# EAGLE design controller (EAGLE 9.6.2)
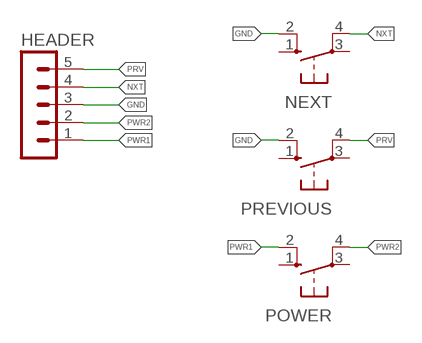
[diagram p0: schematic, sheet 1]

## Parts
HEADER  MA05-1  [MA05-1]
NEXT  10-XX  [B3F-10XX]
POWER  10-XX  [B3F-10XX]
PREVIOUS  10-XX  [B3F-10XX]

## Nets
GND: HEADER.3 NEXT.2(S1) PREVIOUS.2(S1)
NXT: HEADER.4 NEXT.4(P1)
PRV: HEADER.5 PREVIOUS.4(P1)
PWR1: HEADER.1 POWER.2(S1)
PWR2: HEADER.2 POWER.4(P1)
Unconnected: NEXT.1(S) NEXT.3(P) POWER.1(S) POWER.3(P) PREVIOUS.1(S) PREVIOUS.3(P)

## Library data of the parts
HEADER = con-lstb:MA05-1: PIN HEADER; OC_FARNELL: unknown; OC_NEWARK: unknown
NEXT POWER PREVIOUS = switch-omron:10-XX: OMRON SWITCH; MPN: B3F-1000; OC_FARNELL: 176432; OC_NEWARK: 36M3542

## Board
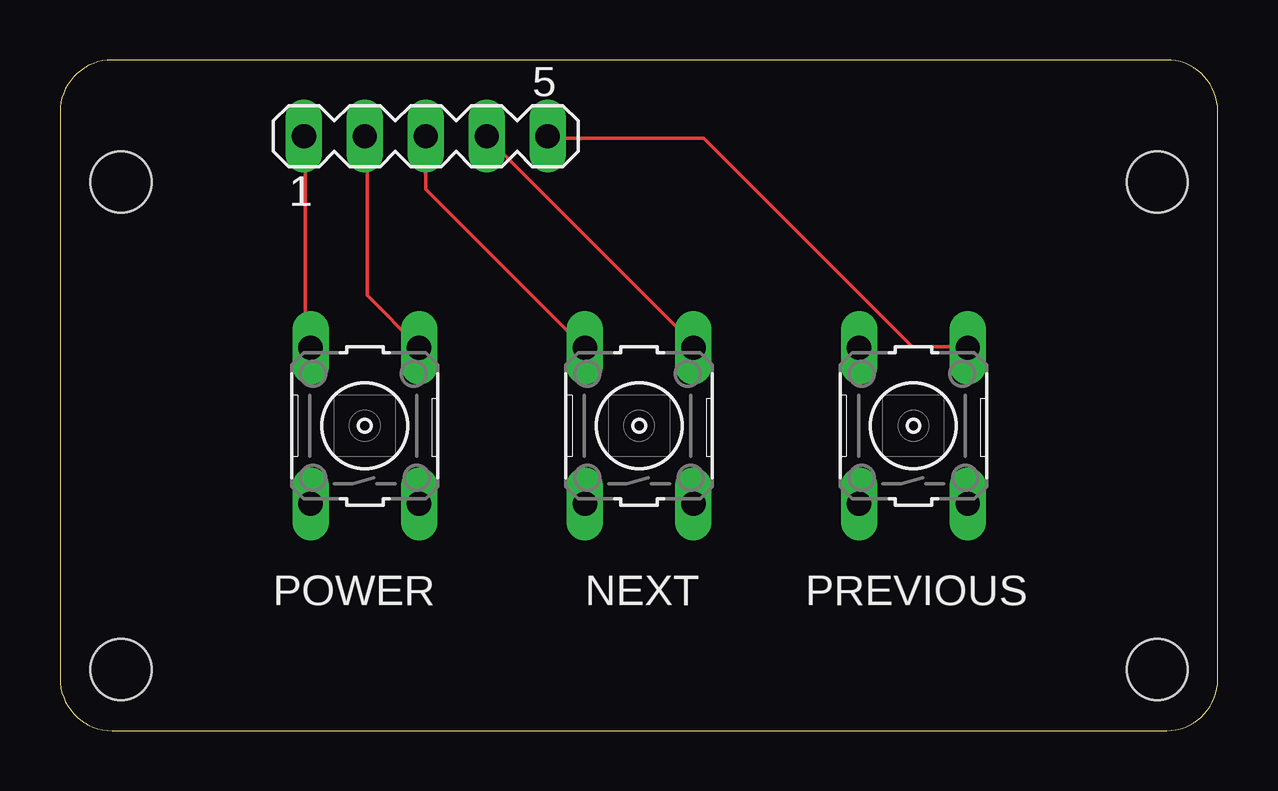
[diagram p1: board, top side]
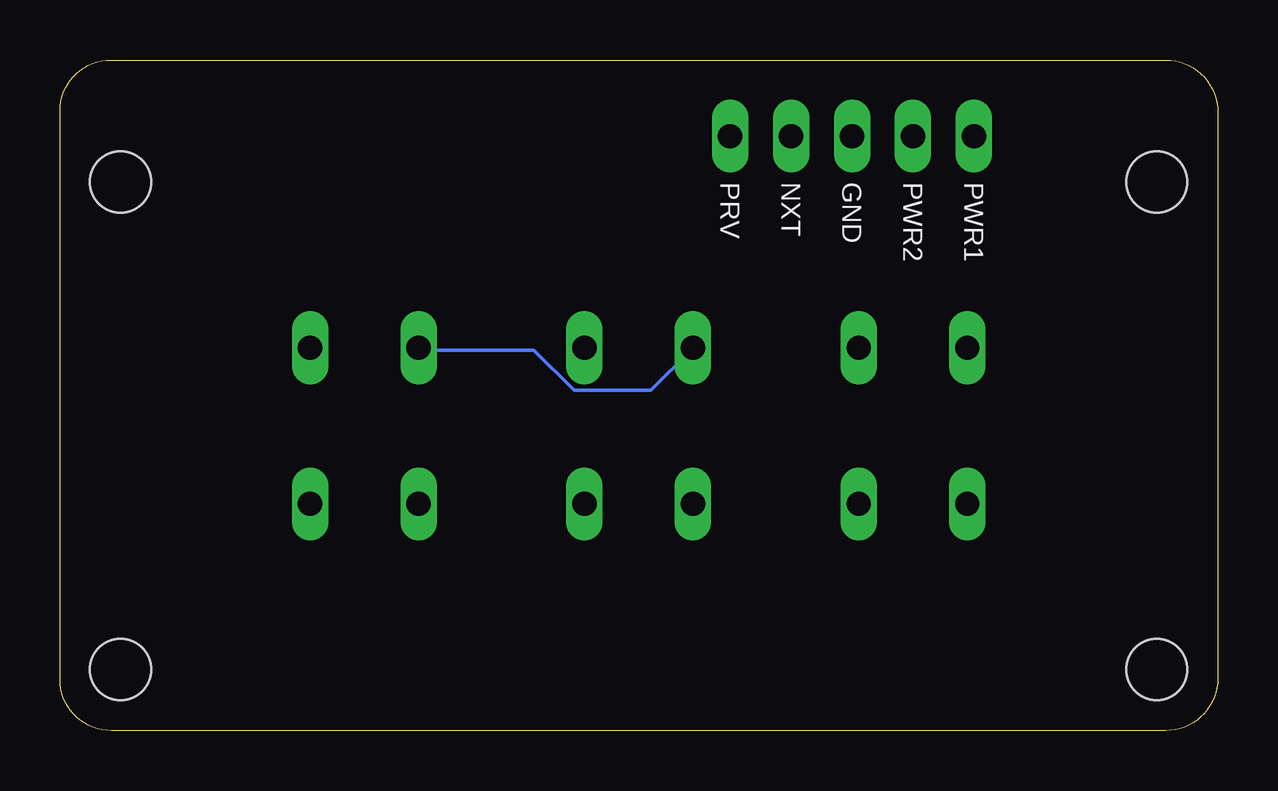
[diagram p2: board, bottom side, seen from below]

Size 48.24 x 27.94 mm. Coordinates in mm from the lower left corner, seen from the top.
Outline: 2.17,0 46.11,0 arc90 48.24,2.13 48.24,25.81 arc90 46.11,27.94 2.17,27.94 arc90 0,25.77 0,2.17 arc90 2.17,0
Copper layers (1*16): Top 0.035mm / dielectric 1.5mm / Bottom 0.035mm
Design rules "default": minimum track width 6mil, minimum drill 0.35mm, track to track 6mil, track to pad 6mil, pad to pad 6mil, via to via 6mil, smd to smd 6mil, copper to edge 40mil, drill to drill 6mil, minimum pad ring 10mil, minimum via ring 8mil, stop-mask expansion 4mil, vias tented up to drill 0mil, thermal gap 10mil
Holes 2.54 mm at 2.54,22.86 2.54,2.54 45.72,22.86 45.72,2.54

### Footprints (pad centres in the part's own frame; a part is rotated, then mirrored left to right if it is on the bottom)
MA05-1 = drill 1.016 long: 1 -5.08,0; 2 -2.54,0; 3 0,0; 4 2.54,0; 5 5.08,0
B3F-10XX = drill 1.016 long: 1 -3.251,2.261; 2 3.251,2.261; 3 -3.251,-2.261; 4 3.251,-2.261

### Placement (x,y rotation side)
HEADER  15.24,24.77 0 top
NEXT  24.13,12.7 90 top
POWER  12.7,12.7 90 top
PREVIOUS  35.56,12.7 90 top

### Tracks (layer width: path | path; a pad name or v marks a point on that pad's centre or on a via)
GND
  Top 0.152: HEADER.3 15.24,22.55 21.79,16 NEXT.2
  Bottom 0.152: PREVIOUS.2 33.22,15.85 28.5,15.85 26.82,14.17 23.62,14.17 21.95,15.85 NEXT.2
NXT
  Top 0.152: HEADER.4 17.83,24.69 26.52,16 NEXT.4
PRV
  Top 0.152: PREVIOUS.4 37.8,16 35.51,16 26.82,24.69 20.42,24.69 HEADER.5
PWR1
  Top 0.152: HEADER.1 10.21,24.69 10.21,16.15 10.36,16 POWER.2
PWR2
  Top 0.152: HEADER.2 12.8,24.69 12.8,18.14 14.94,16 POWER.4

### Text on the board
bNames: PWR1 | PWR2 | GND | NXT | PRV